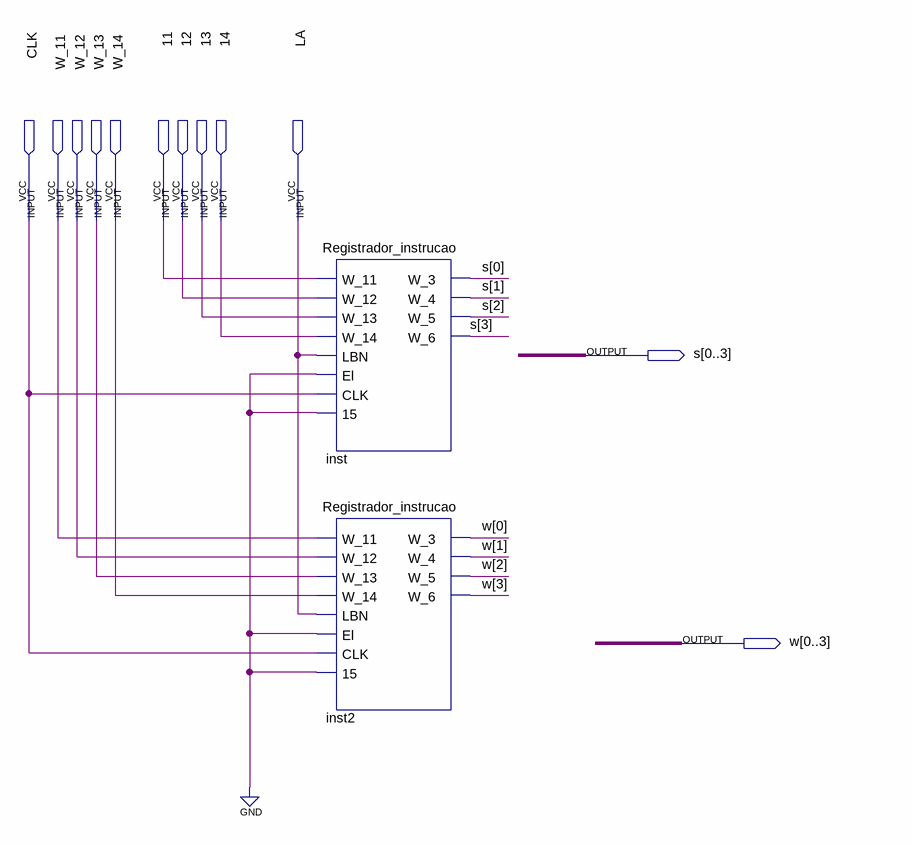
[diagram p0: schematic sheet]
// Quartus schematic Acumulador.bdf as structural Verilog: 2 symbols, 12 pins
module Acumulador (
  input  CLK,
  input  W_11,
  input  W_12,
  input  W_13,
  input  W_14,
  input  \11 ,
  input  \12 ,
  input  \13 ,
  input  \14 ,
  input  LA,
  output [0:3] s,
  output [0:3] w
);

  Registrador_instrucao inst (
    .W_11(\11 ), .W_12(\12 ), .W_13(\13 ), .W_14(\14 ), .LBN(LA), .El(1'b0), .CLK(CLK), .\15 (1'b0),
    .W_3(s[0]), .W_4(s[1]), .W_5(s[2]), .W_6(s[3]));
  Registrador_instrucao inst2 (
    .W_11(W_11), .W_12(W_12), .W_13(W_13), .W_14(W_14), .LBN(LA), .El(1'b0), .CLK(CLK), .\15 (1'b0),
    .W_3(w[0]), .W_4(w[1]), .W_5(w[2]), .W_6(w[3]));
endmodule
